# Altium schematic sheet POWER.SchDoc
size A4; SheetNumber: 1; SheetTotal: 6; SPICEModelCacheUVDKUZOY: <root> / <DocumentId>UVDKUZOY</DocumentId> / <CacheFrame Number="0"> / <Model Name="1280_74477005_5.6u" Kind="CKT"> / <Text>******* / .subckt 1280_74477005_5.6u 1 2 / Rp 1 2 5511 / Cp 1 2 8p / Rs 1 N3 0.0105 / L1 N3 2 5.464u / .ends 1280_74477005_5.6u</Text> / </Model> / </CacheFrame> / </root>
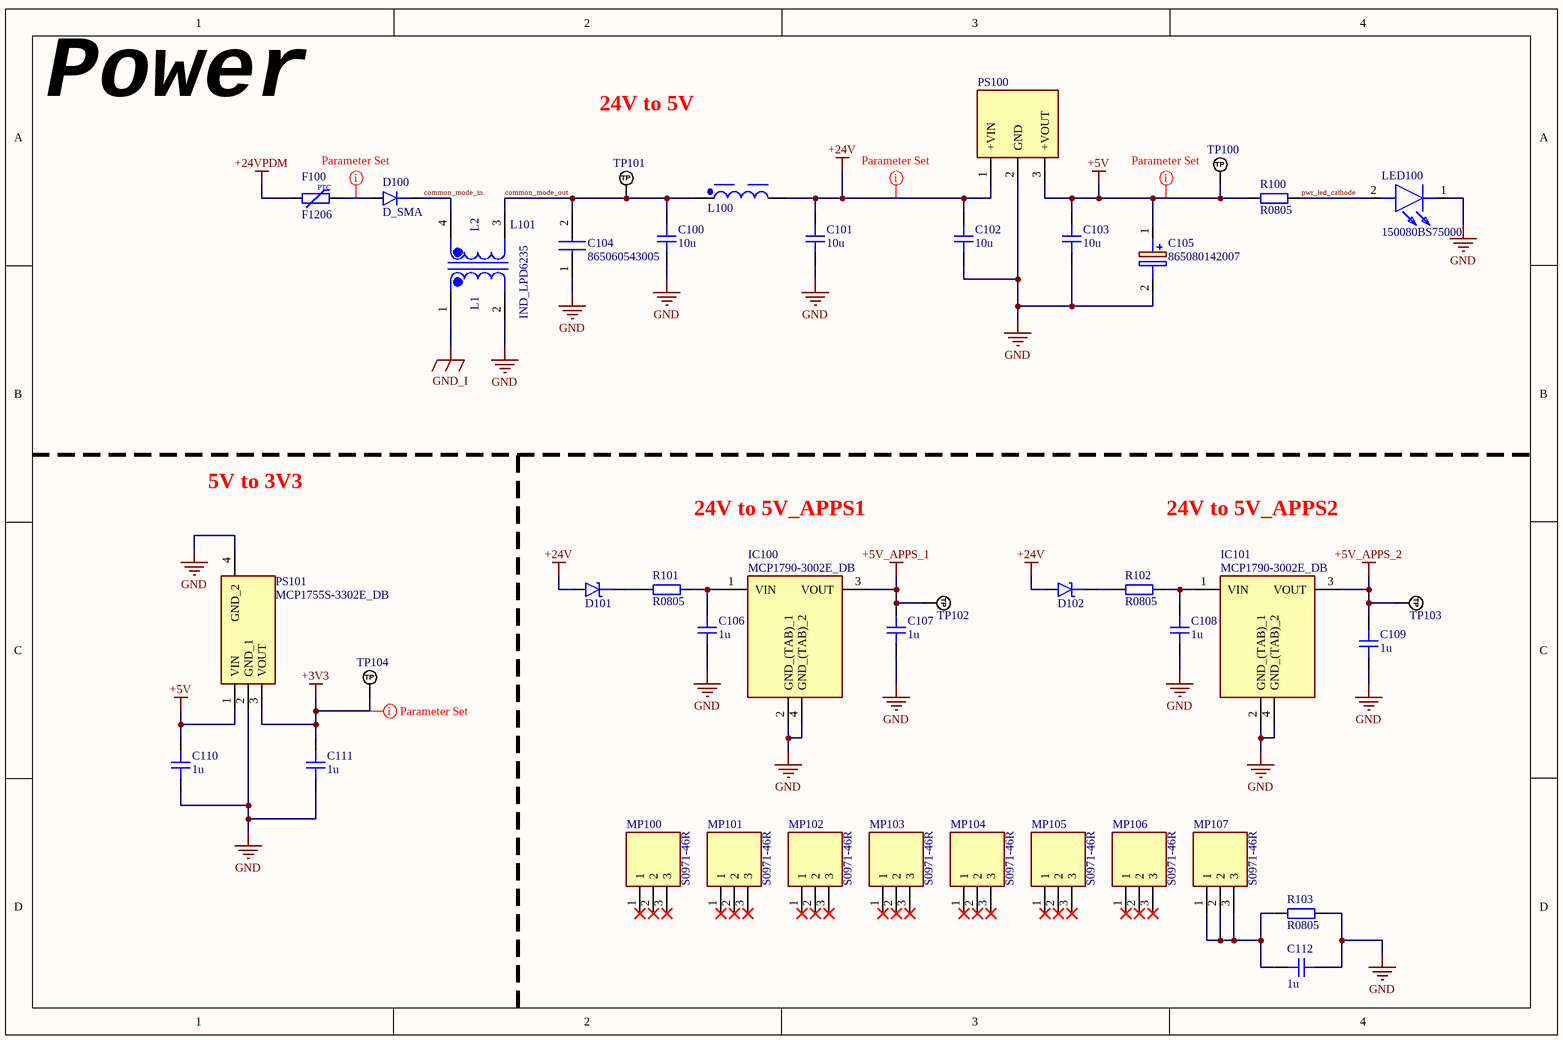
[diagram p0: POWER.SchDoc]

## Parts
C100  10u  [CAP_0805]
C101  10u  [CAP_0805]
C102  10u  [CAP_0805]
C103  10u  [CAP_0805]
C104  865060543005  [865060543005]
C105  865080142007  [CAPAE530X550N]
C106  1u  [CAP_0805]
C107  1u  [CAP_0805]
C108  1u  [CAP_0805]
C109  1u  [CAP_0805]
C110  1u  [CAP_0805]
C111  1u  [CAP_0805]
C112  1u  [CAP_0805]
D100  D_SMA  [DO-214AC-2 (SMA)]
D101  D_SCHOTTKY_SOD_323  [SOD-323]  (value not drawn)
D102  D_SCHOTTKY_SOD_323  [SOD-323]  (value not drawn)
F100  F1206  [FUSE_1206]
IC100  MCP1790-3002E_DB  [SOT230P700X180-4N]
IC101  MCP1790-3002E_DB  [SOT230P700X180-4N]
L100  5.6uH, 8.7A  [WE-PD_1280]  (value not drawn)
L101  IND_LPD6235  [IND_LPD6235]
LED100  150080BS75000  [LEDC2012X80N]
MP100  S0971-46R  [S097146R]
MP101  S0971-46R  [S097146R]
MP102  S0971-46R  [S097146R]
MP103  S0971-46R  [S097146R]
MP104  S0971-46R  [S097146R]
MP105  S0971-46R  [S097146R]
MP106  S0971-46R  [S097146R]
MP107  S0971-46R  [S097146R]
PS100  R-78E5.0-0.5  [R78E5005]  (value not drawn)
PS101  MCP1755S-3302E_DB  [SOT230P700X180-4N]
R100  R0805  [RES_0805]
R101  R0805  [RES_0805]
R102  R0805  [RES_0805]
R103  R0805  [RES_0805]
TP100  TP_NOBOM  [PAD_RND_1MM]  (value not drawn)  (no BOM)
TP101  TP_NOBOM  [PAD_RND_1MM]  (value not drawn)  (no BOM)
TP102  TP_NOBOM  [PAD_RND_1MM]  (value not drawn)  (no BOM)
TP103  TP_NOBOM  [PAD_RND_1MM]  (value not drawn)  (no BOM)
TP104  TP_NOBOM  [PAD_RND_1MM]  (value not drawn)  (no BOM)

## Nets
+3V3: C111.1 PS101.3(VOUT) TP104.1(TP)
+5V: C103.2 C105.1(+) C110.1 PS100.3(+VOUT) PS101.1(VIN) R100.1 TP100.1(TP)
+5V_APPS_1: C107.1 IC100.3(VOUT) TP102.1(TP)
+5V_APPS_2: C109.1 IC101.3(VOUT) TP103.1(TP)
+24V: C101.2 C102.2 D101.A D102.A L100.2 PS100.1(+VIN)
+24VPDM: F100.1
GND: C100.1 C101.1 C102.1 C103.1 C104.1(+) C105.2(-) C106.2 C107.2 C108.2 C109.2 C110.2 C111.2 C112.2 IC100.2(GND_(TAB)_1) IC100.4(GND_(TAB)_2) IC101.2(GND_(TAB)_1) IC101.4(GND_(TAB)_2) L101.2 LED100.1(K) PS100.2(GND) PS101.2(GND_1) PS101.4(GND_2) R103.1
GND_I: L101.1
common_mode_in: D100.K L101.4
common_mode_out: C100.2 C104.2(-) L100.1 L101.3 TP101.1(TP)
pwr_led_cathode: LED100.2(A) R100.2
NetC106_1: C106.1 IC100.1(VIN) R101.1
NetC108_1: C108.1 IC101.1(VIN) R102.1
NetC112_1: C112.1 MP107.1 MP107.2 MP107.3 R103.2
NetD100_A: D100.A F100.2
NetD101_K: D101.K R101.2
NetD102_K: D102.K R102.2

Not connected (* = marked no-connect by the designer): MP100 1* 2* 3*; MP101 1* 2* 3*; MP102 1* 2* 3*; MP103 1* 2* 3*; MP104 1* 2* 3*; MP105 1* 2* 3*; MP106 1* 2* 3*

## Layout directives
net class POWER: +3V3, +5V, +24V, NetD100_A

## Notes on the sheet
- Power
- 24V to 5V
- 5V to 3V3
- 24V to 5V_APPS1
- 24V to 5V_APPS2
- (in symbol FUSE_PPTC_1206) PTC
- (in symbol IND_LPD6235) L2; L1

## Library data of the parts
C100-C103 C106-C112 = CAP_0805_10V: Capacitor SMD 0805 10V
C104 = 865060543005: Capacitor; Manufacturer_Name: Wurth Elektronik; Datasheet Link: https://componentsearchengine.com/Datasheets/1/865060543005.pdf; Height: 5.5mm; Manufacturer_Part_Number: 865060543005; Mouser Part Number: 710-865060543005; Mouser Price/Stock: https://www.mouser.co.uk/ProductDetail/Wurth-Elektronik/865060543005?qs=0KOYDY2FL29pKd1yRWsrOw%3D%3D
C105 = 865080142007: Capacitor Polarised; Manufacturer_Name: Wurth Elektronik; Datasheet Link: https://katalog.we-online.com/pbs/datasheet/865080142007.pdf; Height: 5.5mm; Manufacturer_Part_Number: 865080142007; Mouser Part Number: 710-865080142007; Mouser Price/Stock: https://www.mouser.co.uk/ProductDetail/Wurth-Elektronik/865080142007?qs=0KOYDY2FL2%2Fwso3YmuIP2w%3D%3D
D100 = D_SMA: Diode SMD SMA (DO-214AA)
D101 D102 = D_SCHOTTKY_SOD_323: Diode Schottky SMD SOD-323
F100 = FUSE_PPTC_1206: Fuse PPTC SMD 1206; Manufacturer: *; Manufacturer Part Number: *
IC100 IC101 = MCP1790-3002E_DB: Integrated Circuit; Manufacturer_Name: Microchip; Manufacturer_Part_Number: MCP1790-3002E/DB; Datasheet Link: http://ww1.microchip.com/downloads/en/DeviceDoc/22075b.pdf; Height: 1.8mm; Mouser Part Number: 579-MCP1790-3002E/DB; Mouser Price/Stock: https://www.mouser.co.uk/ProductDetail/Microchip-Technology/MCP1790-3002E-DB?qs=gsqZ4L1luKroJ%252BBibcYbpw%3D%3D; Arrow Part Number: MCP1790-3002E/DB; Arrow Price/Stock: https://www.arrow.com/en/products/mcp1790-3002edb/microchip-technology?region=nac
L100 = 74477005: WE-PD SMT Power Inductor, size 1280, 5.6uH, 8.7A, 13.5mOhm; Manufacturer: Wurth Elektronik; Case/Size Code: 1280; DC Resistance: 10.5mOhm; Saturation Current: 10A; Self Resonant Frequency: 24MHz; Type: Standard; Manufacturer Part Number: 74477005; Category: Power Inductors; Match Code: WE-PD; ComponentLink1Description: Website Link; ComponentLink1URL: https://www.we-online.com/redexpert/article/74477005?ad; ComponentLink2Description: Datasheet Link; ComponentLink2URL: https://www.we-online.com/redexpert/spec/74477005?ad; Mount: Surface Mount; Operating Temperature Max: 125°C; Operating Temperature Min: -40°C; Packaging: Tape and Reel; Length: 12mm; Width: 12mm; Height: 8mm; DC Resistance Max: 13.5mOhm; Inductance: 5.6uH; Rated Current: 8.7A
LED100 = 150080BS75000: LED; Manufacturer_Name: Wurth Elektronik; Datasheet Link: https://katalog.we-online.com/led/datasheet/150080BS75000.pdf; Height: 0.8mm; Manufacturer_Part_Number: 150080BS75000; Mouser Part Number: 710-150080BS75000; Mouser Price/Stock: https://www.mouser.co.uk/ProductDetail/Wurth-Elektronik/150080BS75000?qs=2kOmHSv6VfT2tBo3UPVqAQ%3D%3D
MP100-MP107 = S0971-46R: Mechanical Part; Manufacturer_Name: Harwin; Datasheet Link: https://cdn.harwin.com/pdfs/S0971-46R.pdf; Height: 2.1mm; Manufacturer_Part_Number: S0971-46R; Mouser Part Number: 855-S0971-46R; Mouser Price/Stock: https://www.mouser.co.uk/ProductDetail/Harwin/S0971-46R?qs=AXRVZpzixL%252Bly5Y74siI1Q%3D%3D
PS100 = R-78E5.0-0.5: Power Supply; Manufacturer_Name: RECOM Power; Datasheet Link: https://datasheet.datasheetarchive.com/originals/distributors/Datasheets_SAMA/1560217c2d38d5ce10907af13420fc49.pdf; Height: 10.9mm; Manufacturer_Part_Number: R-78E5.0-0.5; Mouser Part Number: 919-R-78E5.0-0.5; Mouser Price/Stock: https://www.mouser.co.uk/ProductDetail/RECOM-Power/R-78E5.0-0.5?qs=JeAkOuORR2UvBuiB2kZVZQ%3D%3D; Arrow Part Number: R-78E5.0-0.5; Arrow Price/Stock: https://www.arrow.com/en/products/r-78e5.0-0.5/recom-power?region=europe
PS101 = MCP1755S-3302E_DB: Power Supply; Manufacturer_Name: Microchip; Manufacturer_Part_Number: MCP1755S-3302E/DB; Datasheet Link: http://www.farnell.com/datasheets/1697992.pdf; Height: 1.8mm; Mouser Part Number: 579-MCP1755S-3302EDB; Mouser Price/Stock: https://www.mouser.co.uk/ProductDetail/Microchip-Technology/MCP1755S-3302E-DB?qs=OCR3PNzn1cc7Hxpx9CIZgA%3D%3D; Arrow Part Number: MCP1755S-3302E/DB; Arrow Price/Stock: https://www.arrow.com/en/products/mcp1755s-3302edb/microchip-technology?region=nac
R100-R103 = RES_0805: Resistor SMD 0805; Manufacturer: *; Manufacturer Part Number: *; Distributor Link: *; LCSC: *
TP100-TP104 = TEST_POINT_RND_1MM: Test Point Round 1mm (NO BOM)